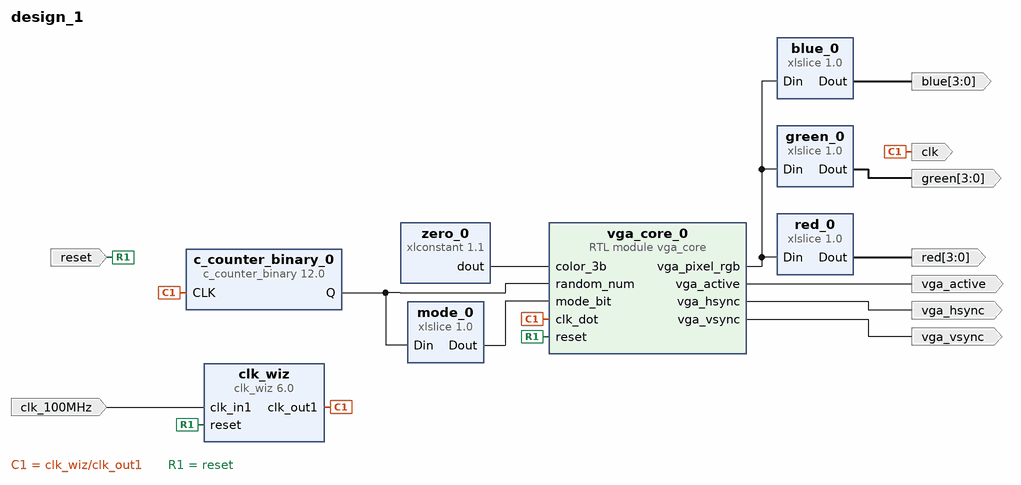
[diagram p0: block diagram of the top level]
# Vivado block design design_1, xcvu9p-flga2104-2L-e, Vivado 2019.1
create_bd_design design_1

create_bd_port -dir O -from 3 -to 0 blue
create_bd_port -dir O -from 3 -to 0 green
create_bd_port -dir O -from 3 -to 0 red
create_bd_port -dir O vga_active
create_bd_port -dir O vga_hsync
create_bd_port -dir O vga_vsync
create_bd_port -dir O -type clk clk
create_bd_port -dir I -type rst reset
set_property -dict {CONFIG.POLARITY ACTIVE_HIGH} [get_bd_ports reset]
create_bd_port -dir I -type clk clk_100MHz
set_property -dict {CONFIG.FREQ_HZ 100000000} [get_bd_ports clk_100MHz]

create_bd_cell -type module -reference vga_core vga_core_0
create_bd_cell -type ip -vlnv xilinx.com:ip:c_counter_binary:12.0 c_counter_binary_0
set_property -dict {CONFIG.Increment_Value 3 CONFIG.Output_Width 32} [get_bd_cells c_counter_binary_0]
create_bd_cell -type ip -vlnv xilinx.com:ip:xlconstant:1.1 zero_0
set_property -dict {CONFIG.CONST_VAL 0} [get_bd_cells zero_0]
create_bd_cell -type ip -vlnv xilinx.com:ip:xlslice:1.0 mode_0
set_property -dict {CONFIG.DIN_FROM 30 CONFIG.DIN_TO 30 CONFIG.DOUT_WIDTH 1} [get_bd_cells mode_0]
create_bd_cell -type ip -vlnv xilinx.com:ip:xlslice:1.0 red_0
set_property -dict {CONFIG.DIN_FROM 23 CONFIG.DIN_TO 20 CONFIG.DIN_WIDTH 24 CONFIG.DOUT_WIDTH 4} [get_bd_cells red_0]
create_bd_cell -type ip -vlnv xilinx.com:ip:xlslice:1.0 green_0
set_property -dict {CONFIG.DIN_FROM 15 CONFIG.DIN_TO 12 CONFIG.DIN_WIDTH 24 CONFIG.DOUT_WIDTH 4} [get_bd_cells green_0]
create_bd_cell -type ip -vlnv xilinx.com:ip:xlslice:1.0 blue_0
set_property -dict {CONFIG.DIN_FROM 7 CONFIG.DIN_TO 4 CONFIG.DIN_WIDTH 24 CONFIG.DOUT_WIDTH 4} [get_bd_cells blue_0]
create_bd_cell -type ip -vlnv xilinx.com:ip:clk_wiz:6.0 clk_wiz
set_property -dict [list \
  CONFIG.CLKOUT1_JITTER 139.033 \
  CONFIG.CLKOUT1_REQUESTED_OUT_FREQ 40 \
  CONFIG.MMCM_CLKOUT0_DIVIDE_F 30.000 \
  CONFIG.RESET_BOARD_INTERFACE reset \
  CONFIG.USE_BOARD_FLOW true \
] [get_bd_cells clk_wiz]

# ---- connections ----

connect_bd_net [get_bd_pins zero_0/dout] [get_bd_pins vga_core_0/color_3b]
connect_bd_net -net clk_wiz_0_clk_out1 [get_bd_pins clk_wiz/clk_out1] \
  [get_bd_pins vga_core_0/clk_dot] [get_bd_ports clk] [get_bd_pins c_counter_binary_0/CLK]
connect_bd_net [get_bd_pins mode_0/Dout] [get_bd_pins vga_core_0/mode_bit]
connect_bd_net -net blue_2_Dout [get_bd_pins blue_0/Dout] [get_bd_ports blue]
connect_bd_net -net green_1_Dout [get_bd_pins green_0/Dout] [get_bd_ports green]
connect_bd_net [get_bd_pins red_0/Dout] [get_bd_ports red]
connect_bd_net [get_bd_pins c_counter_binary_0/Q] [get_bd_pins vga_core_0/random_num] [get_bd_pins mode_0/Din]
connect_bd_net [get_bd_pins vga_core_0/vga_vsync] [get_bd_ports vga_vsync]
connect_bd_net [get_bd_pins vga_core_0/vga_hsync] [get_bd_ports vga_hsync]
connect_bd_net [get_bd_pins vga_core_0/vga_active] [get_bd_ports vga_active]
connect_bd_net [get_bd_pins vga_core_0/vga_pixel_rgb] [get_bd_pins red_0/Din] [get_bd_pins green_0/Din] [get_bd_pins blue_0/Din]
connect_bd_net [get_bd_ports reset] [get_bd_pins clk_wiz/reset] [get_bd_pins vga_core_0/reset]
connect_bd_net [get_bd_ports clk_100MHz] [get_bd_pins clk_wiz/clk_in1]

validate_bd_design
save_bd_design
